# EAGLE schematic arduino_isp_shield (EAGLE 6.4)
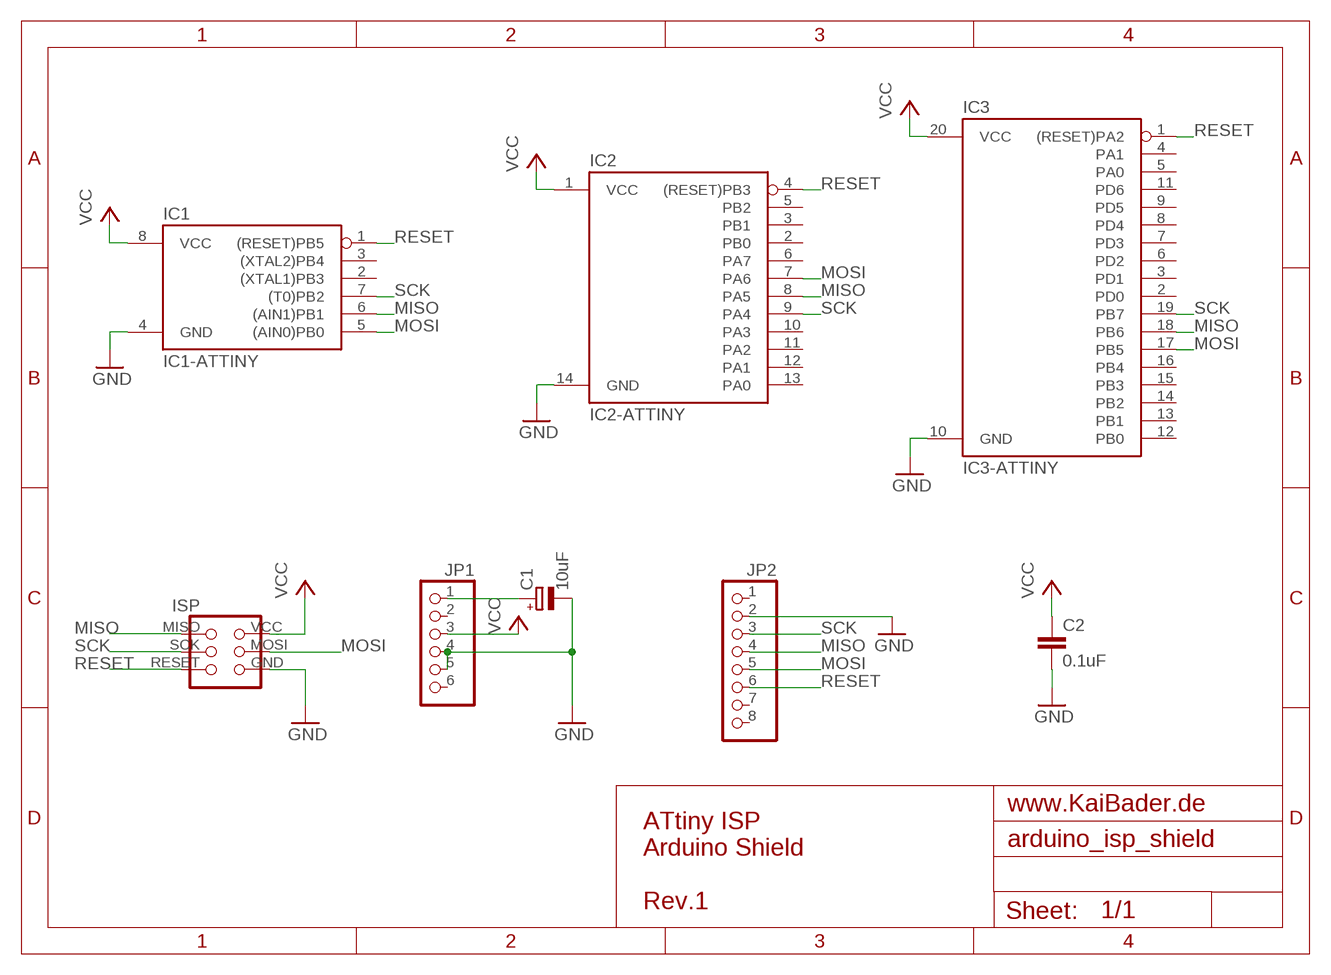
[diagram p0: schematic, sheet 1]

## Parts
C1  10uF  CPOL-EUE1.8-4  [E1,8-4]
C2  0.1uF  C-EU050-025X075  [C050-025X075]
IC1  IC1-ATTINY  TINY85P  [DIL08]
IC2  IC2-ATTINY  TINY84  [DIL14]
IC3  IC3-ATTINY  TINY2313  [DIL20]
ISP  AVR-ISP  [AVR-ISP]
JP1  PINHD-1X6  [1X06]
JP2  PINHD-1X8  [1X08]

## Nets
GND: C1.- C2.2 IC1.4(GND) IC2.14(GND) IC3.10(GND) ISP.GND JP1.4 JP1.5 JP2.2
MISO: IC1.6((AIN1)PB1) IC2.8(PA5) IC3.18(PB6) ISP.MISO JP2.4
MOSI: IC1.5((AIN0)PB0) IC2.7(PA6) IC3.17(PB5) ISP.MOSI JP2.5
N$1: C1.+ JP1.1
RESET: IC1.1((RESET)PB5) IC2.4((RESET)PB3) IC3.1((RESET)PA2) ISP.RESET JP2.6
SCK: IC1.7((T0)PB2) IC2.9(PA4) IC3.19(PB7) ISP.SCK JP2.3
VCC: C2.1 IC1.8(VCC) IC2.1(VCC) IC3.20(VCC) ISP.VCC JP1.3
Unconnected: IC1.2((XTAL1)PB3) IC1.3((XTAL2)PB4) IC2.2(PB0) IC2.3(PB1) IC2.5(PB2) IC2.6(PA7) IC2.10(PA3) IC2.11(PA2) IC2.12(PA1) IC2.13(PA0) IC3.2(PD0) IC3.3(PD1) IC3.4(PA1) IC3.5(PA0) IC3.6(PD2) IC3.7(PD3) IC3.8(PD4) IC3.9(PD5) IC3.11(PD6) IC3.12(PB0) IC3.13(PB1) IC3.14(PB2) IC3.15(PB3) IC3.16(PB4) JP1.2 JP1.6 JP2.1 JP2.7 JP2.8

## Notes on the sheet
- www.KaiBader.de
- ATtiny ISP
  Arduino Shield
  
  Rev.1

## Library data of the parts
C1 = rcl:CPOL-EU: POLARIZED CAPACITOR, European symbol
C2 = rcl:C-EU: CAPACITOR, European symbol
IC1 = kaibader:TINY85: ATtiny85 8-bit AVR Microcontroller, 8KB Flash Pin-compatible to ATtiny25, ATtiny45; OC_FARNELL: unknown; OC_NEWARK: unknown
IC2 = kaibader:TINY84: ATtiny84 8-bit AVR Microcontroller, 8KB Flash Pin-compatible to ATtiny24, ATtiny44
IC3 = kaibader:TINY2313: ATtiny2313 8-bit AVR Microcontroller, 2KB Flash Pin-compatible to ATtiny4313
ISP = kaibader:AVR-ISP: Atmel AVR ISP AVR Microcontroller In-System Programmer pinout
JP1 = pinhead:PINHD-1X6: PIN HEADER
JP2 = pinhead:PINHD-1X8: PIN HEADER